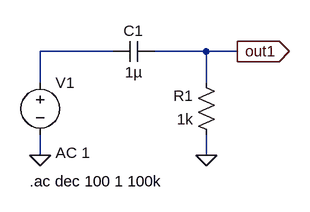
[diagram p0: schematic Frequency_Response_HighPass.asc]
Frequency_Response_HighPass.asc, the LTspice schematic file:
Version 4
SHEET 1 952 680
WIRE 128 80 16 80
WIRE 272 80 192 80
WIRE 320 80 272 80
WIRE 16 128 16 80
WIRE 272 128 272 80
WIRE 16 240 16 208
WIRE 272 240 272 208
FLAG 272 240 0
FLAG 16 240 0
FLAG 320 80 out1
IOPIN 320 80 Out
SYMBOL voltage 16 112 R0
WINDOW 123 24 124 Left 2
WINDOW 39 0 0 Left 0
SYMATTR InstName V1
SYMATTR Value ""
SYMATTR Value2 AC 1
SYMBOL res 288 224 R180
WINDOW 0 36 76 Left 2
WINDOW 3 36 40 Left 2
SYMATTR InstName R1
SYMATTR Value 1k
SYMBOL cap 192 64 R90
WINDOW 0 0 32 VBottom 2
WINDOW 3 32 32 VTop 2
SYMATTR InstName C1
SYMATTR Value 1µ
TEXT 0 280 Left 2 !.ac dec 100 1 100k

The netlist it stands for:
* Frequency_Response_HighPass.asc
V1 N001 0 AC 1
R1 0 out1 1k
C1 out1 N001 1µ
.ac dec 100 1 100k
.backanno
.end